# EAGLE design chloe (EAGLE 7.3.0)
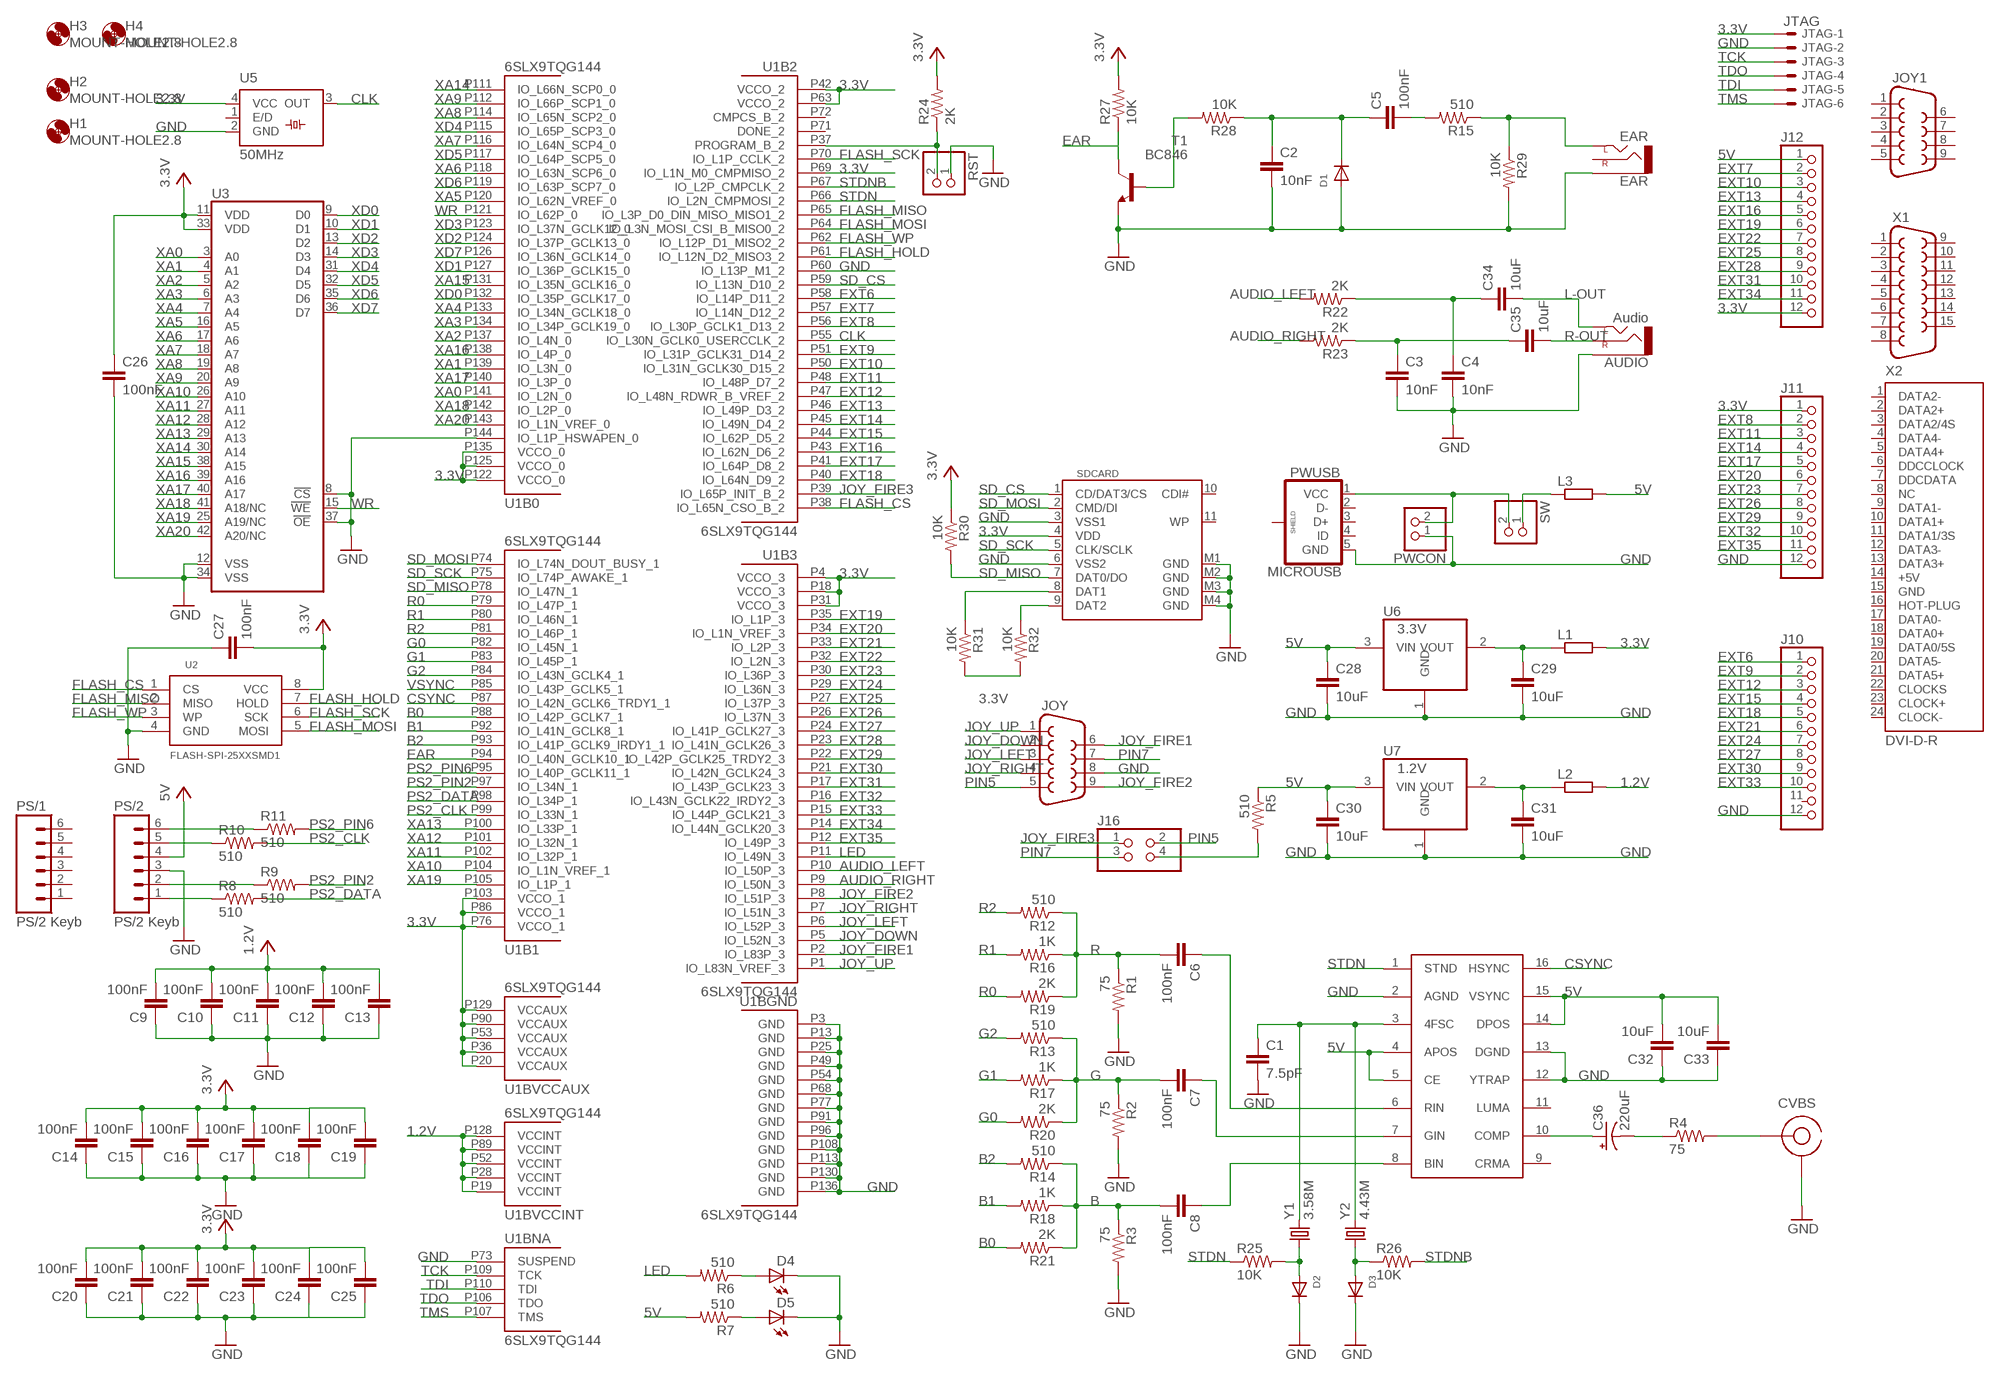
[diagram p0: schematic, sheet 1]

## Parts
AUDIO  Audio  AUDIO-JACKPTH  [AUDIO-JACK]
C1  7.5pF  C-EUC0805  [C0805]
C2  10nF  C-EUC0805  [C0805]
C3  10nF  C-EUC0805  [C0805]
C4  10nF  C-EUC0805  [C0805]
C5  100nF  C-EUC0603  [C0603]
C6  100nF  C-EUC0603  [C0603]
C7  100nF  C-EUC0603  [C0603]
C8  100nF  C-EUC0603  [C0603]
C9  100nF  C-EUC0603  [C0603]
C10  100nF  C-EUC0603  [C0603]
C11  100nF  C-EUC0603  [C0603]
C12  100nF  C-EUC0603  [C0603]
C13  100nF  C-EUC0603  [C0603]
C14  100nF  C-EUC0603  [C0603]
C15  100nF  C-EUC0603  [C0603]
C16  100nF  C-EUC0603  [C0603]
C17  100nF  C-EUC0603  [C0603]
C18  100nF  C-EUC0603  [C0603]
C19  100nF  C-EUC0603  [C0603]
C20  100nF  C-EUC0603  [C0603]
C21  100nF  C-EUC0603  [C0603]
C22  100nF  C-EUC0603  [C0603]
C23  100nF  C-EUC0603  [C0603]
C24  100nF  C-EUC0603  [C0603]
C25  100nF  C-EUC0603  [C0603]
C26  100nF  C-EUC0603  [C0603]
C27  100nF  C-EUC0603  [C0603]
C28  10uF  C-EUC0805  [C0805]
C29  10uF  C-EUC0805  [C0805]
C30  10uF  C-EUC0805  [C0805]
C31  10uF  C-EUC0805  [C0805]
C32  10uF  C-EUC0805  [C0805]
C33  10uF  C-EUC0805  [C0805]
C34  10uF  C-EUC0805  [C0805]
C35  10uF  C-EUC0805  [C0805]
C36  220uF  CPOL-US153CLV-0605  [153CLV-0605]
CVBS  RCA  [RCA]
D1  DIODESOD-323F  [SOD-323F]
D2  DIODESOD-323F  [SOD-323F]
D3  DIODESOD-323F  [SOD-323F]
D4  LEDCHIP-LED0805  [CHIP-LED0805]
D5  LEDCHIP-LED0805  [CHIP-LED0805]
EAR  EAR  AUDIO-JACKPTH  [AUDIO-JACK]
H1  MOUNT-HOLE2.8  [2,8]
H2  MOUNT-HOLE2.8  [2,8]
H3  MOUNT-HOLE2.8  [2,8]
H4  MOUNT-HOLE2.8  [2,8]
J10  PINHD-1X12  [1X12]
J11  PINHD-1X12  [1X12]
J12  PINHD-1X12  [1X12]
J16  PINHD-2X2  [2X02]
JOY  DB9MALE  [DB9_MALE]
JOY1  DB9MALE  [DB9_MALE]
JTAG  JTAG  53047-06  [53047-06]
L1  R-EU_M0805  [M0805]
L2  R-EU_M0805  [M0805]
L3  R-EU_M0805  [M0805]
PS/1  PS/2 Keyb  DINC_MIN_TM_6_1  [DINC/MIN_TM/6_1PRIMARY]
PS/2  PS/2 Keyb  DINC_MIN_TM_6_1  [DINC/MIN_TM/6_1PRIMARY]
PWCON  PINHD-1X2  [1X02]
PWUSB  MICROUSB  [MICRO_USB_1PRIMARY]
R1  75  R-US_M0805  [M0805]
R2  75  R-US_M0805  [M0805]
R3  75  R-US_M0805  [M0805]
R4  75  R-US_M0805  [M0805]
R5  510  R-US_M0805  [M0805]
R6  510  R-US_M0805  [M0805]
R7  510  R-US_M0805  [M0805]
R8  510  R-US_M0805  [M0805]
R9  510  R-US_M0805  [M0805]
R10  510  R-US_M0805  [M0805]
R11  510  R-US_M0805  [M0805]
R12  510  R-US_M0805  [M0805]
R13  510  R-US_M0805  [M0805]
R14  510  R-US_M0805  [M0805]
R15  510  R-US_M0805  [M0805]
R16  1K  R-US_M0805  [M0805]
R17  1K  R-US_M0805  [M0805]
R18  1K  R-US_M0805  [M0805]
R19  2K  R-US_M0805  [M0805]
R20  2K  R-US_M0805  [M0805]
R21  2K  R-US_M0805  [M0805]
R22  2K  R-US_M0805  [M0805]
R23  2K  R-US_M0805  [M0805]
R24  2K  R-US_M0805  [M0805]
R25  10K  R-US_M0805  [M0805]
R26  10K  R-US_M0805  [M0805]
R27  10K  R-US_M0805  [M0805]
R28  10K  R-US_M0805  [M0805]
R29  10K  R-US_M0805  [M0805]
R30  10K  R-US_M0805  [M0805]
R31  10K  R-US_M0805  [M0805]
R32  10K  R-US_M0805  [M0805]
RST  PINHD-1X2  [1X02]
SDCARD  SDCARD  [SDCMF-10915W010]
SW  PINHD-1X2  [1X02]
T1  BC846  [SOT23]
U1  6SLX9TQG144  [TQ144]
U2  FLASH-SPI-25XXSMD1  [SO08-EIAJ]
U3  ISSI_SRAM_8BIT  [TSOP44-II]
U4  AD724  AD725  [SO16W]
U5  50MHz  SM_OSC_1  [SM/OSC_1PRIMARY]
U6  3.3V  REG1117  [SOT223]
U7  1.2V  REG1117  [SOT223]
X1  F15HDH  [HDF15H]
X2  DVI-D-R  [DVI-D-R]
Y1  3.58M  CRYSTALHC49UP  [HC49UP]
Y2  4.43M  CRYSTALHC49UP  [HC49UP]

## Nets
1.2V: C9.2 C10.2 C11.2 C12.2 C13.2 L2.2 U1.P19(BVCCINT:VCCINT) U1.P28(BVCCINT:VCCINT) U1.P52(BVCCINT:VCCINT) U1.P89(BVCCINT:VCCINT) U1.P128(BVCCINT:VCCINT)
3.3V: C14.2 C15.2 C16.2 C17.2 C18.2 C19.2 C20.2 C21.2 C22.2 C23.2 C24.2 C25.2 C26.1 C27.2 J11.1 J12.12 JTAG.1 L1.2 R24.2 R27.2 R30.1 R31.2 R32.2 SDCARD.4(VDD) U1.P4(B3:VCCO_3) U1.P18(B3:VCCO_3) U1.P20(BVCCAUX:VCCAUX) U1.P31(B3:VCCO_3) U1.P36(BVCCAUX:VCCAUX) U1.P42(B2:VCCO_2) U1.P53(BVCCAUX:VCCAUX) U1.P63(B2:VCCO_2) U1.P69(B2:IO_L1N_M0_CMPMISO_2) U1.P76(B1:VCCO_1) U1.P86(B1:VCCO_1) U1.P90(BVCCAUX:VCCAUX) U1.P103(B1:VCCO_1) U1.P122(B0:VCCO_0) U1.P125(B0:VCCO_0) U1.P129(BVCCAUX:VCCAUX) U1.P135(B0:VCCO_0) U2.8(VCC) U3.11(VDD) U3.33(VDD) U5.4(VCC)
5V: C28.1 C30.1 C32.2 C33.2 J12.1 L3.2 PS/2.4 R5.1 R7.2 U4.4(APOS) U4.5(CE) U4.14(DPOS) U4.15(VSYNC) U6.3(VIN) U7.3(VIN)
AUDIO_LEFT: R22.2 U1.P10(B3:IO_L50P_3)
AUDIO_RIGHT: R23.2 U1.P9(B3:IO_L50N_3)
B: C8.2 R3.1 R14.1 R18.1 R21.1
B0: R21.2 U1.P88(B1:IO_L42P_GCLK7_1)
B1: R18.2 U1.P92(B1:IO_L41N_GCLK8_1)
B2: R14.2 U1.P93(B1:IO_L41P_GCLK9_IRDY1_1)
CLK: U1.P55(B2:IO_L30N_GCLK0_USERCCLK_2) U5.3(OUT)
CSYNC: U1.P87(B1:IO_L42N_GCLK6_TRDY1_1) U4.16(HSYNC)
EAR: R27.1 T1.3(C) U1.P94(B1:IO_L40N_GCLK10_1)
EXT6: J10.1 U1.P58(B2:IO_L14P_D11_2)
EXT7: J12.2 U1.P57(B2:IO_L14N_D12_2)
EXT8: J11.2 U1.P56(B2:IO_L30P_GCLK1_D13_2)
EXT9: J10.2 U1.P51(B2:IO_L31P_GCLK31_D14_2)
EXT10: J12.3 U1.P50(B2:IO_L31N_GCLK30_D15_2)
EXT11: J11.3 U1.P48(B2:IO_L48P_D7_2)
EXT12: J10.3 U1.P47(B2:IO_L48N_RDWR_B_VREF_2)
EXT13: J12.4 U1.P46(B2:IO_L49P_D3_2)
EXT14: J11.4 U1.P45(B2:IO_L49N_D4_2)
EXT15: J10.4 U1.P44(B2:IO_L62P_D5_2)
EXT16: J12.5 U1.P43(B2:IO_L62N_D6_2)
EXT17: J11.5 U1.P41(B2:IO_L64P_D8_2)
EXT18: J10.5 U1.P40(B2:IO_L64N_D9_2)
EXT19: J12.6 U1.P35(B3:IO_L1P_3)
EXT20: J11.6 U1.P34(B3:IO_L1N_VREF_3)
EXT21: J10.6 U1.P33(B3:IO_L2P_3)
EXT22: J12.7 U1.P32(B3:IO_L2N_3)
EXT23: J11.7 U1.P30(B3:IO_L36P_3)
EXT24: J10.7 U1.P29(B3:IO_L36N_3)
EXT25: J12.8 U1.P27(B3:IO_L37P_3)
EXT26: J11.8 U1.P26(B3:IO_L37N_3)
EXT27: J10.8 U1.P24(B3:IO_L41P_GCLK27_3)
EXT28: J12.9 U1.P23(B3:IO_L41N_GCLK26_3)
EXT29: J11.9 U1.P22(B3:IO_L42P_GCLK25_TRDY2_3)
EXT30: J10.9 U1.P21(B3:IO_L42N_GCLK24_3)
EXT31: J12.10 U1.P17(B3:IO_L43P_GCLK23_3)
EXT32: J11.10 U1.P16(B3:IO_L43N_GCLK22_IRDY2_3)
EXT33: J10.10 U1.P15(B3:IO_L44P_GCLK21_3)
EXT34: J12.11 U1.P14(B3:IO_L44N_GCLK20_3)
EXT35: J11.11 U1.P12(B3:IO_L49P_3)
FLASH_CS: U1.P38(B2:IO_L65N_CSO_B_2) U2.1(CS)
FLASH_HOLD: U1.P61(B2:IO_L12N_D2_MISO3_2) U2.7(HOLD)
FLASH_MISO: U1.P65(B2:IO_L3P_D0_DIN_MISO_MISO1_2) U2.2(MISO)
FLASH_MOSI: U1.P64(B2:IO_L3N_MOSI_CSI_B_MISO0_2) U2.5(MOSI)
FLASH_SCK: U1.P70(B2:IO_L1P_CCLK_2) U2.6(SCK)
FLASH_WP: U1.P62(B2:IO_L12P_D1_MISO2_2) U2.3(WP)
G: C7.2 R2.1 R13.1 R17.1 R20.1
G0: R20.2 U1.P82(B1:IO_L45N_1)
G1: R17.2 U1.P83(B1:IO_L45P_1)
G2: R13.2 U1.P84(B1:IO_L43N_GCLK4_1)
GND: AUDIO.SLEEVE C1.2 C2.2 C3.2 C4.2 C9.1 C10.1 C11.1 C12.1 C13.1 C14.1 C15.1 C16.1 C17.1 C18.1 C19.1 C20.1 C21.1 C22.1 C23.1 C24.1 C25.1 C26.2 C27.1 C28.2 C29.2 C30.2 C31.2 C32.1 C33.1 CVBS.GND D1.A D2.C D3.C D4.C D5.C EAR.SLEEVE J10.12 J11.12 JOY.8 JTAG.2 PS/2.3 PWCON.1 PWUSB.5(GND) R1.2 R2.2 R3.2 R29.2 RST.1 SDCARD.3(VSS1) SDCARD.6(VSS2) SDCARD.M1(GND) SDCARD.M2(GND) SDCARD.M3(GND) SDCARD.M4(GND) T1.2(E) U1.P3(BGND:GND) U1.P13(BGND:GND) U1.P25(BGND:GND) U1.P49(BGND:GND) U1.P54(BGND:GND) U1.P60(B2:IO_L13P_M1_2) U1.P68(BGND:GND) U1.P73(BNA:SUSPEND) U1.P77(BGND:GND) U1.P91(BGND:GND) U1.P96(BGND:GND) U1.P108(BGND:GND) U1.P113(BGND:GND) U1.P130(BGND:GND) U1.P136(BGND:GND) U1.P144(B0:IO_L1P_HSWAPEN_0) U2.4(GND) U3.8(!CS) U3.12(VSS) U3.34(VSS) U3.37(!OE) U4.2(AGND) U4.12(YTRAP) U4.13(DGND) U5.2(GND) U6.1(GND) U7.1(GND)
JOY_DOWN: JOY.2 U1.P5(B3:IO_L52N_3)
JOY_FIRE1: JOY.6 U1.P2(B3:IO_L83P_3)
JOY_FIRE2: JOY.9 U1.P8(B3:IO_L51P_3)
JOY_FIRE3: J16.1 U1.P39(B2:IO_L65P_INIT_B_2)
JOY_LEFT: JOY.3 U1.P6(B3:IO_L52P_3)
JOY_RIGHT: JOY.4 U1.P7(B3:IO_L51N_3)
JOY_UP: JOY.1 U1.P1(B3:IO_L83N_VREF_3)
L-OUT: AUDIO.TIP(LEFT) C34.2
LED: R6.2 U1.P11(B3:IO_L49N_3)
N$1: PS/2.6 R11.1
N$2: PS/2.5 R10.1
N$3: PS/2.2 R9.1
N$4: PS/2.1 R8.1
N$5: R24.1 RST.2 U1.P37(B2:PROGRAM_B_2)
N$6: R28.2 T1.1(B)
N$7: C2.1 C5.1 D1.C R28.1
N$8: C5.2 R15.2
N$9: EAR.TIP(LEFT) R15.1 R29.1
N$10: C3.1 C35.1 R23.1
N$11: C4.1 C34.1 R22.1
N$12: PWCON.2 PWUSB.1(VCC) SW.2
N$13: L3.1 SW.1
N$14: C29.1 L1.1 U6.2(VOUT)
N$15: J16.4 R5.2
N$17: C31.1 L2.1 U7.2(VOUT)
N$18: R31.1 SDCARD.8(DAT1)
N$19: C8.1 U4.8(BIN)
N$20: R32.1 SDCARD.9(DAT2)
N$21: C7.1 U4.7(GIN)
N$22: C6.1 U4.6(RIN)
N$23: C1.1 U4.3(4FSC) Y1.2 Y2.2
N$24: D3.A R26.1 Y2.1
N$25: D2.A R25.2 Y1.1
N$26: C36.+ U4.10(COMP)
N$27: C36.- R4.1
N$28: CVBS.SIG R4.2
N$31: D4.A R6.1
N$32: D5.A R7.1
PIN5: J16.2 JOY.5
PIN7: J16.3 JOY.7
PS2_CLK: R10.2 U1.P99(B1:IO_L33N_1)
PS2_DATA: R8.2 U1.P98(B1:IO_L34P_1)
PS2_PIN2: R9.2 U1.P97(B1:IO_L34N_1)
PS2_PIN6: R11.2 U1.P95(B1:IO_L40P_GCLK11_1)
R: C6.2 R1.1 R12.1 R16.1 R19.1
R0: R19.2 U1.P79(B1:IO_L47P_1)
R1: R16.2 U1.P80(B1:IO_L46N_1)
R2: R12.2 U1.P81(B1:IO_L46P_1)
R-OUT: AUDIO.RING(RIGHT) C35.2
SD_CS: SDCARD.1(CD/DAT3/CS) U1.P59(B2:IO_L13N_D10_2)
SD_MISO: R30.2 SDCARD.7(DAT0/DO) U1.P78(B1:IO_L47N_1)
SD_MOSI: SDCARD.2(CMD/DI) U1.P74(B1:IO_L74N_DOUT_BUSY_1)
SD_SCK: SDCARD.5(CLK/SCLK) U1.P75(B1:IO_L74P_AWAKE_1)
STDN: R25.1 U1.P66(B2:IO_L2N_CMPMOSI_2) U4.1(STND)
STDNB: R26.2 U1.P67(B2:IO_L2P_CMPCLK_2)
TCK: JTAG.3 U1.P109(BNA:TCK)
TDI: JTAG.5 U1.P110(BNA:TDI)
TDO: JTAG.4 U1.P106(BNA:TDO)
TMS: JTAG.6 U1.P107(BNA:TMS)
VSYNC: U1.P85(B1:IO_L43P_GCLK5_1)
WR: U1.P121(B0:IO_L62P_0) U3.15(!WE)
XA0: U1.P141(B0:IO_L2N_0) U3.3(A0)
XA1: U1.P139(B0:IO_L3N_0) U3.4(A1)
XA2: U1.P137(B0:IO_L4N_0) U3.5(A2)
XA3: U1.P134(B0:IO_L34P_GCLK19_0) U3.6(A3)
XA4: U1.P133(B0:IO_L34N_GCLK18_0) U3.7(A4)
XA5: U1.P120(B0:IO_L62N_VREF_0) U3.16(A5)
XA6: U1.P118(B0:IO_L63N_SCP6_0) U3.17(A6)
XA7: U1.P116(B0:IO_L64N_SCP4_0) U3.18(A7)
XA8: U1.P114(B0:IO_L65N_SCP2_0) U3.19(A8)
XA9: U1.P112(B0:IO_L66P_SCP1_0) U3.20(A9)
XA10: U1.P104(B1:IO_L1N_VREF_1) U3.26(A10)
XA11: U1.P102(B1:IO_L32P_1) U3.27(A11)
XA12: U1.P101(B1:IO_L32N_1) U3.28(A12)
XA13: U1.P100(B1:IO_L33P_1) U3.29(A13)
XA14: U1.P111(B0:IO_L66N_SCP0_0) U3.30(A14)
XA15: U1.P131(B0:IO_L35N_GCLK16_0) U3.38(A15)
XA16: U1.P138(B0:IO_L4P_0) U3.39(A16)
XA17: U1.P140(B0:IO_L3P_0) U3.40(A17)
XA18: U1.P142(B0:IO_L2P_0) U3.41(A18/NC)
XA19: U1.P105(B1:IO_L1P_1) U3.25(A19/NC)
XA20: U1.P143(B0:IO_L1N_VREF_0) U3.42(A20/NC)
XD0: U1.P132(B0:IO_L35P_GCLK17_0) U3.9(D0)
XD1: U1.P127(B0:IO_L36P_GCLK15_0) U3.10(D1)
XD2: U1.P124(B0:IO_L37P_GCLK13_0) U3.13(D2)
XD3: U1.P123(B0:IO_L37N_GCLK12_0) U3.14(D3)
XD4: U1.P115(B0:IO_L65P_SCP3_0) U3.31(D4)
XD5: U1.P117(B0:IO_L64P_SCP5_0) U3.32(D5)
XD6: U1.P119(B0:IO_L63P_SCP7_0) U3.35(D6)
XD7: U1.P126(B0:IO_L36N_GCLK14_0) U3.36(D7)
Unconnected: EAR.RING(RIGHT) J10.11 JOY1.1 JOY1.2 JOY1.3 JOY1.4 JOY1.5 JOY1.6 JOY1.7 JOY1.8 JOY1.9 PS/1.1 PS/1.2 PS/1.3 PS/1.4 PS/1.5 PS/1.6 PWUSB.2(D-) PWUSB.3(D+) PWUSB.4(ID) PWUSB.6(SHIELD) SDCARD.10(CDI#) SDCARD.11(WP) U1.P71(B2:DONE_2) U1.P72(B2:CMPCS_B_2) U4.9(CRMA) U4.11(LUMA) U5.1(E/D) X1.1 X1.2 X1.3 X1.4 X1.5 X1.6 X1.7 X1.8 X1.9 X1.10 X1.11 X1.12 X1.13 X1.14 X1.15 X2.1(DATA2-) X2.2(DATA2+) X2.3(DATA2/4S) X2.4(DATA4-) X2.5(DATA4+) X2.6(DDCCLOCK) X2.7(DDCDATA) X2.8(NC) X2.9(DATA1-) X2.10(DATA1+) X2.11(DATA1/3S) X2.12(DATA3-) X2.13(DATA3+) X2.16(HOT-PLUG) X2.17(DATA0-) X2.18(DATA0+) X2.19(DATA0/5S) X2.20(DATA5-) X2.21(DATA5+) X2.22(CLOCKS) X2.23(CLOCK+) X2.24(CLOCK-)

## Power pins joined to a net without a drawn wire
+5V: X2.14(+5V)
GND: X2.15(GND)

## Library data of the parts
AUDIO EAR = SparkFun-Connectors:AUDIO-JACK: 3.5mm Audio Jack Simple 3.5mm common PCB mount audio jack. SKU: PRT-08032
C1-C35 = rcl:C-EU: CAPACITOR, European symbol
C36 = rcl:CPOL-US: POLARIZED CAPACITOR, American symbol
CVBS = uzebox:RCA: RCA jack
D1-D3 = adafruit:DIODE: Diode SMADIODE - SMA Surface Mount Package 20V 1A Schottky Diode Digikey: 641-1014-6-ND DO-1N4148 - Through Hole Small Current Diode SOD-123 20V 1 A (.5mV Vf) Schottky Diode - Digikey: MBRX120TPMSCT-ND SOD-323 10V 570mA (.38mV Vf, 3ns) Schottky Diode - Digikey: ZLLS410CT-ND SOD-523 30V 30mA Schottky Diode (RB751S-40TE61) - Digikey: RB751S-40TE61CT-ND SOT23-R/W - SOT23 Package (R = Solder Paste/Reflow Ovens, W = Hand-Soldering) BAT54Film 40V 300mA - Digikey: 497-7162-1-ND
D4 D5 = led:LED: LED OSRAM: - CHIPLED LG R971, LG N971, LY N971, LG Q971, LY Q971, LO R971, LY R971 LH N974, LH R974 LS Q976, LO Q976, LY Q976 LO Q996 - Hyper CHIPLED LW Q18S LB Q993, LB Q99A, LB R99A - SideLED LS A670, LO A670, LY A670, LG A670, LP A670 LB A673, LV A673, LT A673, LW A673 LH A674 LY A675 LS A676, LA A676, LO A676, LY A676, LW A676 LS A679, LY A679, LG A679 - Hyper Micro SIDELED® LS Y876, LA Y876, LO Y876, LY Y876 LT Y87S - SmartLED LW L88C, LW L88S LB L89C, LB L89S, LG L890 LS L89K, LO L89K, LY L89K LS L896, LA L896, LO L896, LY L896 - TOPLED LS T670, LO T670, LY T670, LG T670, LP T670 LSG T670, LSP T670, LSY T670, LOP T670, LYG T670 LG T671, LOG T671, LSG T671 LB T673, LV T673, LT T673, LW T673 LH T674 LS T676, LA T676, LO T676, LY T676, LB T676, LH T676, LSB T676, LW T676 LB T67C, LV T67C, LT T67C, LS T67K, LO T67K, LY T67K, LW E67C LS E67B, LA E67B, LO E67B, LY E67B, LB E67C, LV E67C, LT E67C LW T67C LS T679, LY T679, LG T679 LS T770, LO T770, LY T770, LG T770, LP T770 LB T773, LV T773, LT T773, LW T773 LH T774 LS E675, LA E675, LY E675, LS T675 LS T776, LA T776, LO T776, LY T776, LB T776 LHGB T686 LT T68C, LB T68C - Hyper Mini TOPLED® LB M676 - Mini TOPLED Santana® LG M470 LS M47K, LO M47K, LY M47K Source: http://www.osram.convergy.de LUXEON: - LUMILED® LXK2-PW12-R00, LXK2-PW12-S00, LXK2-PW14-U00, LXK2-PW14-V00 LXK2-PM12-R00, LXK2-PM12-S00, LXK2-PM14-U00 LXK2-PE12-Q00, LXK2-PE12-R00, LXK2-PE12-S00, LXK2-PE14-T00, LXK2-PE14-U00 LXK2-PB12-K00, LXK2-PB12-L00, LXK2-PB12-M00, LXK2-PB14-N00, LXK2-PB14-P00, LXK2-PB14-Q00 LXK2-PR12-L00, LXK2-PR12-M00, LXK2-PR14-Q00, LXK2-PR14-R00 LXK2-PD12-Q00, LXK2-PD12-R00, LXK2-PD12-S00 LXK2-PH12-R00, LXK2-PH12-S00 LXK2-PL12-P00, LXK2-PL12-Q00, LXK2-PL12-R00 Source: www.luxeon.com KINGBRIGHT: KA-3528ASYC Source: www.kingbright.com
H1-H4 = holes:MOUNT-HOLE: MOUNTING HOLE with drill center marker
J10-J12 = pinhead:PINHD-1X12: PIN HEADER
J16 = pinhead:PINHD-2X2: PIN HEADER
JOY JOY1 = SparkFun-Connectors:DB9: DB9 Connector Standard DB9 (D-Sub 9) serial connector. Can be used for CAN bus as well as RS485 and RS232. Footprint production proven. Spark Fun Electronics SKU : PRT-00429
JTAG = con-molex:53?-06: CONNECTOR wire to board 1.25 mm (.049 inch) pitch header; MPN: 53047-0610-C; OC_FARNELL: 9733078; OC_NEWARK: 03M2965
L1-L3 = rcl:R-EU_: RESISTOR, European symbol
PS/1 PS/2 = ZX_UNO_0_14:DINC_MIN_TM_6_1
PWCON RST SW = pinhead:PINHD-1X2: PIN HEADER
PWUSB = zxuno_rev_mcleod:MICROUSB
R1-R32 = rcl:R-US_: RESISTOR, American symbol
SDCARD = zxuno_rev_mcleod:SDCARD: SD card connector KINGFONT SDCMF-10915W010
T1 = transistor:BC846: NPN TRANSISTOR
U1 = xilinx_devices_V6:6SLX9TQG144: Xilinx FPGA: 6SLX9TQG144
U2 = GadgetFactory:FLASH-SPI-25XX: SPI Flash
U3 = GadgetFactory:ISSI_SRAM_8BIT
U4 = ad725:AD725
U5 = ZX_UNO_0_15:SM_OSC_1
U6 U7 = burr-brown:REG1117: 800mA and 1A Low Dropout (LDO) Positive Regulator 1.8V, 2.5V, 2.85V, 3.3V, 5V, and Adj; MPN: REG1117; OC_FARNELL: 1097566; OC_NEWARK: 14P6981
X1 = con-subd:F15: SUB-D; OC_FARNELL: unknown; OC_NEWARK: unknown
X2 = con-molex:DVI-D-R: CONNECTOR MiroCross(TM)-DVI i/0 plug and receptacle connector system (scart); OC_FARNELL: unknown; OC_NEWARK: unknown
Y1 Y2 = crystal:CRYSTAL: CRYSTAL; OC_FARNELL: unknown; OC_NEWARK: unknown

## Board
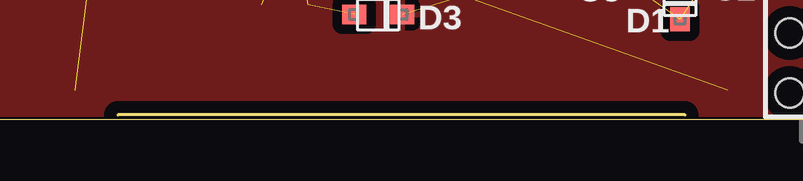
[diagram p1: board, top side]
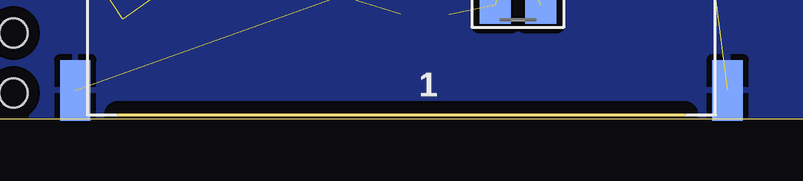
[diagram p2: board, bottom side, seen from below]

Size 23.62 x 0 mm. Coordinates in mm from the lower left corner, seen from the top.
Copper layers (1*16): Top 0.035mm / dielectric 1.5mm / Bottom 0.035mm
Design rules "EagleRules": minimum track width 7mil, minimum drill 12mil, track to track 7mil, track to pad 7mil, pad to pad 7mil, via to via 7mil, smd to smd 0mil, copper to edge 20mil, drill to drill 10mil, minimum pad ring 10mil, minimum via ring 6mil, stop-mask expansion 2mil, vias tented up to drill 25mil, thermal gap 10mil
Milling: 4 lines

### Footprints (pad centres in the part's own frame; a part is rotated, then mirrored left to right if it is on the bottom)
AUDIO-JACK = drill 1.3 pad 2.184: RING 5,5; RSH 5,2.5; SLEEVE 0,0; TIP 5,-5; TSH 5,-2.5 | hole 1.2: 0,5; -2.5,5; -2.5,-5; 0,-5; 5,0
C0805 = smd 1.3 x 1.5: 1 -0.95,0; 2 0.95,0
C0603 = smd 1.1 x 1: 1 -0.85,0; 2 0.85,0
153CLV-0605 = smd 3.5 x 1.6: + 2.7,0; - -2.7,0
RCA = drill 2.3 pad 3.81: GND 0,0; SIG 0,-4.5 | hole 2.8: -4.175,3.15; 4.175,3.15
SOD-323F = smd 1 x 0.8: A -1,0; C 1,0
CHIP-LED0805 = smd 1.2 x 1.2: A 0,-1.05; C 0,1.05
2,8 = hole 2.8: 0,0
1X12 = drill 1.016 octagon: 1 -13.97,0; 2 -11.43,0; 3 -8.89,0; 4 -6.35,0; 5 -3.81,0; 6 -1.27,0; 7 1.27,0; 8 3.81,0; 9 6.35,0; 10 8.89,0; 11 11.43,0; 12 13.97,0
2X02 = drill 1.016 octagon: 1 -1.27,-1.27; 2 -1.27,1.27; 3 1.27,-1.27; 4 1.27,1.27
DB9_MALE = drill 1.016 pad 1.88: 1 5.54,-1.42; 2 2.77,-1.42; 3 0,-1.42; 4 -2.77,-1.42; 5 -5.54,-1.42; 6 4.15,1.42; 7 1.38,1.42; 8 -1.38,1.42; 9 -4.15,1.42 | drill 3.302 pad 5.08: G1 -12.5,0; G2 12.5,0
53047-06 = drill 0.5 pad 0.698 long: 1 3.125,0.45; 2 1.875,0.45; 3 0.625,0.45; 4 -0.625,0.45; 5 -1.875,0.45; 6 -3.125,0.45
M0805 = smd 1.3 x 1.6: 1 -0.95,0; 2 0.95,0
DINC/MIN_TM/6_1PRIMARY = drill 0.889 pad 1.575 square: 1 -1.295,-8.509 | drill 0.889 pad 1.575: 2 1.295,-8.509; 3 -3.353,-8.509; 4 3.353,-8.509; 5 -3.353,-10.998; 6 3.353,-10.998 | drill 2.311 pad 2.845: 7 -6.756,-5.512; 8 0,-4.699; 9 6.756,-5.512
1X02 = drill 1.016 octagon: 1 -1.27,0; 2 1.27,0
MICRO_USB_1PRIMARY = smd 0.406 x 2.108: 1 -1.295,0.381; 2 -0.66,0.381; 3 0,0.381; 4 0.66,0.381; 5 1.295,0.381 | smd 7.366 x 4.191 bottom: 6 0,-1.524 | drill 1.194 pad 1.538 square: 7 -2.87,-2.667; 8 2.87,-2.667 | hole 0.457: -2.007,-0.533; 2.007,-0.533
SDCMF-10915W010 = smd 0.711 x 1.422: 1 7.366,13.462; 2 4.826,13.462; 3 2.286,13.462; 4 -0.254,13.462; 5 -2.794,13.462; 6 -5.334,13.462; 7 -7.874,13.462; 8 -9.398,13.462; 9 9.906,13.462; 10 -11.938,13.462; 11 -10.668,13.462 | smd 1.27 x 2.54: M1 12.192,11.43; M2 13.97,-2.54; M3 -13.208,-2.54; M4 -13.208,11.43 | hole 1.6: 9.906,10.414 | hole 1.1: -11.176,10.414
SOT23 = smd 1 x 1.4: 1 -0.95,-1.1; 2 0.95,-1.1; 3 0,1.1
TQ144 = smd 1.6 x 0.3: P1 -11.1,8.75; P2 -11.1,8.25; P3 -11.1,7.75; P4 -11.1,7.25; P5 -11.1,6.75; P6 -11.1,6.25; P7 -11.1,5.75; P8 -11.1,5.25; P9 -11.1,4.75; P10 -11.1,4.25; P11 -11.1,3.75; P12 -11.1,3.25; P13 -11.1,2.75; P14 -11.1,2.25; P15 -11.1,1.75; P16 -11.1,1.25; P17 -11.1,0.75; P18 -11.1,0.25; P19 -11.1,-0.25; P20 -11.1,-0.75; P21 -11.1,-1.25; P22 -11.1,-1.75; P23 -11.1,-2.25; P24 -11.1,-2.75; P25 -11.1,-3.25; P26 -11.1,-3.75; P27 -11.1,-4.25; P28 -11.1,-4.75; P29 -11.1,-5.25; P30 -11.1,-5.75; P31 -11.1,-6.25; P32 -11.1,-6.75; P33 -11.1,-7.25; P34 -11.1,-7.75; P35 -11.1,-8.25; P36 -11.1,-8.75; P73 11.1,-8.75; P74 11.1,-8.25; P75 11.1,-7.75; P76 11.1,-7.25; P77 11.1,-6.75; P78 11.1,-6.25; P79 11.1,-5.75; P80 11.1,-5.25; P81 11.1,-4.75; P82 11.1,-4.25; P83 11.1,-3.75; P84 11.1,-3.25; P85 11.1,-2.75; P86 11.1,-2.25; P87 11.1,-1.75; P88 11.1,-1.25; P89 11.1,-0.75; P90 11.1,-0.25; P91 11.1,0.25; P92 11.1,0.75; P93 11.1,1.25; P94 11.1,1.75; P95 11.1,2.25; P96 11.1,2.75; P97 11.1,3.25; P98 11.1,3.75; P99 11.1,4.25; P100 11.1,4.75; P101 11.1,5.25; P102 11.1,5.75; P103 11.1,6.25; P104 11.1,6.75; P105 11.1,7.25; P106 11.1,7.75; P107 11.1,8.25; P108 11.1,8.75 | smd 0.3 x 1.6: P37 -8.75,-11.1; P38 -8.25,-11.1; P39 -7.75,-11.1; P40 -7.25,-11.1; P41 -6.75,-11.1; P42 -6.25,-11.1; P43 -5.75,-11.1; P44 -5.25,-11.1; P45 -4.75,-11.1; P46 -4.25,-11.1; P47 -3.75,-11.1; P48 -3.25,-11.1; P49 -2.75,-11.1; P50 -2.25,-11.1; P51 -1.75,-11.1; P52 -1.25,-11.1; P53 -0.75,-11.1; P54 -0.25,-11.1; P55 0.25,-11.1; P56 0.75,-11.1; P57 1.25,-11.1; P58 1.75,-11.1; P59 2.25,-11.1; P60 2.75,-11.1; P61 3.25,-11.1; P62 3.75,-11.1; P63 4.25,-11.1; P64 4.75,-11.1; P65 5.25,-11.1; P66 5.75,-11.1; P67 6.25,-11.1; P68 6.75,-11.1; P69 7.25,-11.1; P70 7.75,-11.1; P71 8.25,-11.1; P72 8.75,-11.1; P109 8.75,11.1; P110 8.25,11.1; P111 7.75,11.1; P112 7.25,11.1; P113 6.75,11.1; P114 6.25,11.1; P115 5.75,11.1; P116 5.25,11.1; P117 4.75,11.1; P118 4.25,11.1; P119 3.75,11.1; P120 3.25,11.1; P121 2.75,11.1; P122 2.25,11.1; P123 1.75,11.1; P124 1.25,11.1; P125 0.75,11.1; P126 0.25,11.1; P127 -0.25,11.1; P128 -0.75,11.1; P129 -1.25,11.1; P130 -1.75,11.1; P131 -2.25,11.1; P132 -2.75,11.1; P133 -3.25,11.1; P134 -3.75,11.1; P135 -4.25,11.1; P136 -4.75,11.1; P137 -5.25,11.1; P138 -5.75,11.1; P139 -6.25,11.1; P140 -6.75,11.1; P141 -7.25,11.1; P142 -7.75,11.1; P143 -8.25,11.1; P144 -8.75,11.1
SO08-EIAJ = smd 0.61 x 2.21: 1 -1.905,-3.378; 2 -0.635,-3.378; 3 0.635,-3.378; 4 1.905,-3.378; 5 1.905,3.353; 6 0.635,3.353; 7 -0.635,3.353; 8 -1.905,3.353
TSOP44-II = smd 0.4 x 1.3: 1 -8.4,-5.8; 2 -7.6,-5.8; 3 -6.8,-5.8; 4 -6,-5.8; 5 -5.2,-5.8; 6 -4.4,-5.8; 7 -3.6,-5.8; 8 -2.8,-5.8; 9 -2,-5.8; 10 -1.2,-5.8; 11 -0.4,-5.8; 12 0.4,-5.8; 13 1.2,-5.8; 14 2,-5.8; 15 2.8,-5.8; 16 3.6,-5.8; 17 4.4,-5.8; 18 5.2,-5.8; 19 6,-5.8; 20 6.8,-5.8; 21 7.6,-5.8; 22 8.4,-5.8; 23 8.4,5.8; 24 7.6,5.8; 25 6.8,5.8; 26 6,5.8; 27 5.2,5.8; 28 4.4,5.8; 29 3.6,5.8; 30 2.8,5.8; 31 2,5.8; 32 1.2,5.8; 33 0.4,5.8; 34 -0.4,5.8; 35 -1.2,5.8; 36 -2,5.8; 37 -2.8,5.8; 38 -3.6,5.8; 39 -4.4,5.8; 40 -5.2,5.8; 41 -6,5.8; 42 -6.8,5.8; 43 -7.6,5.8; 44 -8.4,5.8
SO16W = smd 0.6 x 2.2: 1 -4.445,-4.6; 2 -3.175,-4.6; 3 -1.905,-4.6; 4 -0.635,-4.6; 5 0.635,-4.6; 6 1.905,-4.6; 7 3.175,-4.6; 8 4.445,-4.6; 9 4.445,4.6; 10 3.175,4.6; 11 1.905,4.6; 12 0.635,4.6; 13 -0.635,4.6; 14 -1.905,4.6; 15 -3.175,4.6; 16 -4.445,4.6
SM/OSC_1PRIMARY = smd 1.778 x 1.981: 1 0,0; 2 -5.08,0; 3 -5.08,-4.191; 4 0,-4.191
SOT223 = smd 1.499 x 2.007: 1 -2.261,-3.15; 2 0.025,-3.15; 3 2.311,-3.15 | smd 3.81 x 2.007: 4 0,3.15
HDF15H = drill 0.9 octagon: 1 4.329,2.54 | drill 0.9: 2 2.043,2.54; 3 -0.243,2.54; 4 -2.529,2.54; 5 -4.815,2.54; 6 5.472,0; 7 3.186,0; 8 0.9,0; 9 -1.386,0; 10 -3.672,0; 11 4.329,-2.54; 12 2.043,-2.54; 13 -0.243,-2.54; 14 -2.529,-2.54; 15 -4.815,-2.54 | hole 3: -12.5,0; 12.5,0
DVI-D-R = drill 0.864 pad 1.397: 1 -9.525,6.985; 2 -7.62,6.985; 3 -5.715,6.985; 4 -3.81,6.985; 5 -1.905,6.985; 6 0,6.985; 7 1.905,6.985; 8 3.81,6.985; 9 -9.525,5.08; 10 -7.62,5.08; 11 -5.715,5.08; 12 -3.81,5.08; 13 -1.905,5.08; 14 0,5.08; 15 1.905,5.08; 16 3.81,5.08; 17 -9.525,3.175; 18 -7.62,3.175; 19 -5.715,3.175; 20 -3.81,3.175; 21 -1.905,3.175; 22 0,3.175; 23 1.905,3.175; 24 3.81,3.175 | hole 1.93: -15.367,3.175; 15.367,3.175; -9.525,-0.127; 9.525,-0.127
HC49UP = smd 5.334 x 1.93: 1 -4.826,0; 2 4.826,0

### Placement (x,y rotation side)
AUDIO  -23.95,12.88 0 top  (outside the outline)
C1  1.4,9.51 180 top  (outside the outline)
C2  25.37,7.92 90 top  (outside the outline)
C3  53.59,43.84 90 top  (outside the outline)
C4  49.14,43.84 90 top  (outside the outline)
C5  20.76,6.49 0 top  (outside the outline)
C6  0.44,13.16 270 top  (outside the outline)
C7  2.98,12.68 270 top  (outside the outline)
C8  0.92,16.34 0 top  (outside the outline)
C9  20.88,40.74 0 bottom  (outside the outline)
C10  27.83,40.74 0 bottom  (outside the outline)
C11  34.75,32.67 270 bottom  (outside the outline)
C12  25.31,22.19 0 bottom  (outside the outline)
C13  16.2,34.16 270 bottom  (outside the outline)
C14  24.04,40.74 180 bottom  (outside the outline)
C15  33.01,40.74 0 bottom  (outside the outline)
C16  34.77,36.46 270 bottom  (outside the outline)
C17  34.71,29.08 90 bottom  (outside the outline)
C18  30.05,22.19 180 bottom  (outside the outline)
C19  21.76,22.17 180 bottom  (outside the outline)
C20  16.99,22.17 180 bottom  (outside the outline)
C21  16.18,25.86 90 bottom  (outside the outline)
C22  16.18,31.02 90 bottom  (outside the outline)
C23  16.2,37.23 90 bottom  (outside the outline)
C24  27.19,36.24 180 bottom  (outside the outline)
C25  2.98,41.26 180 bottom  (outside the outline)
C26  54.86,31.22 90 top  (outside the outline)
C27  -8.92,26.81 270 top  (outside the outline)
C28  -16.22,15.7 0 top  (outside the outline)
C29  -22.26,15.7 180 top  (outside the outline)
C30  -13.11,21.64 180 top  (outside the outline)
C31  -14.45,24.64 180 top  (outside the outline)
C32  1.4,7.29 0 top  (outside the outline)
C33  -16.22,13.16 180 top  (outside the outline)
C34  46.92,43.84 90 top  (outside the outline)
C35  55.81,43.84 90 top  (outside the outline)
C36  27.43,51.1 90 top  (outside the outline)
CVBS  -21.07,24.79 270 top  (outside the outline)
D1  23.42,4.98 270 top  (outside the outline)
D2  -23.57,2.44 180 top  (outside the outline)
D3  10.84,4.18 0 top  (outside the outline)
D4  53.31,54.12 270 top  (outside the outline)
D5  53.31,51.26 270 top  (outside the outline)
EAR  32.99,3.41 90 top  (outside the outline)
H1  68.98,68.41 0 top  (outside the outline)
H2  -24.96,67.81 0 top  (outside the outline)
H3  68.03,3.44 0 top  (outside the outline)
H4  -24.96,3.16 0 top  (outside the outline)
J10  -5.39,69.79 0 top  (outside the outline)
J11  -6.66,67.25 0 top  (outside the outline)
J12  -5.39,64.71 0 top  (outside the outline)
J16  53.43,18.44 180 top  (outside the outline)
JOY  50.01,61.82 0 top  (outside the outline)
JOY1  18.46,61.66 0 top  (outside the outline)
JTAG  43.74,20.19 0 top  (outside the outline)
L1  -21.15,27.92 0 top  (outside the outline)
L2  -8.55,31.27 90 top  (outside the outline)
L3  -20.19,11.89 90 top  (outside the outline)
PS/1  50.49,0.14 180 top  (outside the outline)
PS/2  71.6,15.46 270 top  (outside the outline)
PWCON  -17.65,8.08 90 top  (outside the outline)
PWUSB  -12.79,2.74 0 top  (outside the outline)
R1  16.8,10.14 0 top  (outside the outline)
R2  16.8,8.08 0 top  (outside the outline)
R3  16.8,6.02 0 top  (outside the outline)
R4  38.5,47.01 180 top  (outside the outline)
R5  42.35,12.84 180 top  (outside the outline)
R6  47.75,54.12 180 top  (outside the outline)
R7  47.75,51.26 180 top  (outside the outline)
R8  42.35,8.4 180 top  (outside the outline)
R9  42.35,6.18 180 top  (outside the outline)
R10  42.35,10.62 180 top  (outside the outline)
R11  42.35,3.95 180 top  (outside the outline)
R12  6.16,10.62 0 top  (outside the outline)
R13  11.72,7.13 90 top  (outside the outline)
R14  17.27,13.32 90 top  (outside the outline)
R15  32.19,12.53 180 top  (outside the outline)
R16  6.16,12.68 0 top  (outside the outline)
R17  9.65,7.13 90 top  (outside the outline)
R18  15.21,13.32 90 top  (outside the outline)
R19  6.16,14.75 0 top  (outside the outline)
R20  6.32,8.24 0 top  (outside the outline)
R21  12.67,13.32 90 top  (outside the outline)
R22  44.7,43.84 90 top  (outside the outline)
R23  51.36,43.84 90 top  (outside the outline)
R24  7.67,41.26 0 top  (outside the outline)
R25  -6.06,7.45 0 bottom  (outside the outline)
R26  6.95,4.59 0 bottom  (outside the outline)
R27  20.45,12.05 270 top  (outside the outline)
R28  21.08,8.72 0 top  (outside the outline)
R29  27.59,12.53 180 top  (outside the outline)
R30  -4.48,18.88 0 top  (outside the outline)
R31  -8.76,19.45 270 top  (outside the outline)
R32  -21.97,32.02 180 top  (outside the outline)
RST  8.22,47.29 315 top  (outside the outline)
SDCARD  12.19,3.56 0 bottom
SW  -14.95,8.08 270 top  (outside the outline)
T1  23.46,12.21 0 top  (outside the outline)
U1  25.49,31.46 270 top  (outside the outline)
U2  -4.64,25.54 0 top  (outside the outline)
U3  47.08,31.69 270 top  (outside the outline)
U4  6.12,28.84 90 top  (outside the outline)
U5  27.95,29.39 180 bottom  (outside the outline)
U6  -21.15,21.57 0 top  (outside the outline)
U7  -13.4,30.15 0 top  (outside the outline)
X1  -16.5,46.34 270 top  (outside the outline)
X2  68.71,40.94 90 top  (outside the outline)
Y1  -3.84,40.19 0 top  (outside the outline)
Y2  -3.92,45.55 180 top  (outside the outline)

### Tracks (layer width: path | path; a pad name or v marks a point on that pad's centre or on a via)
1.2V  (10 unrouted)
3.3V  (44 unrouted)
5V  (14 unrouted)
AUDIO_LEFT  (1 unrouted)
AUDIO_RIGHT  (1 unrouted)
B  (4 unrouted)
B0  (1 unrouted)
B1  (1 unrouted)
B2  (1 unrouted)
CLK  (1 unrouted)
CSYNC  (1 unrouted)
EAR  (2 unrouted)
EXT6  (1 unrouted)
EXT7  (1 unrouted)
EXT8  (1 unrouted)
EXT9  (1 unrouted)
EXT10  (1 unrouted)
EXT11  (1 unrouted)
EXT12  (1 unrouted)
EXT13  (1 unrouted)
EXT14  (1 unrouted)
EXT15  (1 unrouted)
EXT16  (1 unrouted)
EXT17  (1 unrouted)
EXT18  (1 unrouted)
EXT19  (1 unrouted)
EXT20  (1 unrouted)
EXT21  (1 unrouted)
EXT22  (1 unrouted)
EXT23  (1 unrouted)
EXT24  (1 unrouted)
EXT25  (1 unrouted)
EXT26  (1 unrouted)
EXT27  (1 unrouted)
EXT28  (1 unrouted)
EXT29  (1 unrouted)
EXT30  (1 unrouted)
EXT31  (1 unrouted)
EXT32  (1 unrouted)
EXT33  (1 unrouted)
EXT34  (1 unrouted)
EXT35  (1 unrouted)
FLASH_CS  (1 unrouted)
FLASH_HOLD  (1 unrouted)
FLASH_MISO  (1 unrouted)
FLASH_MOSI  (1 unrouted)
FLASH_SCK  (1 unrouted)
FLASH_WP  (1 unrouted)
G  (4 unrouted)
G0  (1 unrouted)
G1  (1 unrouted)
G2  (1 unrouted)
GND  (83 unrouted)
  pour Bottom (isolate 0.406): -27.91,55.65 57.91,55.65 57.91,-0.02 -27.81,-0.02
  pour Top (isolate 0.406): -27.77,0 57.91,0 57.91,55.63 -27.77,55.63
JOY_DOWN  (1 unrouted)
JOY_FIRE1  (1 unrouted)
JOY_FIRE2  (1 unrouted)
JOY_FIRE3  (1 unrouted)
JOY_LEFT  (1 unrouted)
JOY_RIGHT  (1 unrouted)
JOY_UP  (1 unrouted)
L-OUT  (1 unrouted)
LED  (1 unrouted)
N$1  (1 unrouted)
N$2  (1 unrouted)
N$3  (1 unrouted)
N$4  (1 unrouted)
N$5  (2 unrouted)
N$6  (1 unrouted)
N$7  (3 unrouted)
N$8  (1 unrouted)
N$9  (2 unrouted)
N$10  (2 unrouted)
N$11  (2 unrouted)
N$12  (2 unrouted)
N$13  (1 unrouted)
N$14  (2 unrouted)
N$15  (1 unrouted)
N$17  (2 unrouted)
N$18  (1 unrouted)
N$19  (1 unrouted)
N$20  (1 unrouted)
N$21  (1 unrouted)
N$22  (1 unrouted)
N$23  (3 unrouted)
N$24  (2 unrouted)
N$25  (2 unrouted)
N$26  (1 unrouted)
N$27  (1 unrouted)
N$28  (1 unrouted)
N$31  (1 unrouted)
N$32  (1 unrouted)
PIN5  (1 unrouted)
PIN7  (1 unrouted)
PS2_CLK  (1 unrouted)
PS2_DATA  (1 unrouted)
PS2_PIN2  (1 unrouted)
PS2_PIN6  (1 unrouted)
R  (4 unrouted)
R0  (1 unrouted)
R1  (1 unrouted)
R2  (1 unrouted)
R-OUT  (1 unrouted)
SD_CS  (1 unrouted)
SD_MISO  (2 unrouted)
SD_MOSI  (1 unrouted)
SD_SCK  (1 unrouted)
STDN  (2 unrouted)
STDNB  (1 unrouted)
TCK  (1 unrouted)
TDI  (1 unrouted)
TDO  (1 unrouted)
TMS  (1 unrouted)
WR  (1 unrouted)
XA0  (1 unrouted)
XA1  (1 unrouted)
XA2  (1 unrouted)
XA3  (1 unrouted)
XA4  (1 unrouted)
XA5  (1 unrouted)
XA6  (1 unrouted)
XA7  (1 unrouted)
XA8  (1 unrouted)
XA9  (1 unrouted)
XA10  (1 unrouted)
XA11  (1 unrouted)
XA12  (1 unrouted)
XA13  (1 unrouted)
XA14  (1 unrouted)
XA15  (1 unrouted)
XA16  (1 unrouted)
XA17  (1 unrouted)
XA18  (1 unrouted)
XA19  (1 unrouted)
XA20  (1 unrouted)
XD0  (1 unrouted)
XD1  (1 unrouted)
XD2  (1 unrouted)
XD3  (1 unrouted)
XD4  (1 unrouted)
XD5  (1 unrouted)
XD6  (1 unrouted)
XD7  (1 unrouted)

### Text on the board
tPlace: (C)2016 ZX-Uno Team / http://www.zxuno.com | v4.1
tNames: 1 | 1 | 1
bNames: 1 | 1 | 1
_tNames: C36 | R6 | J10 | D4 | R7 | J11 | D5 | J12 | C34 | R23 | AUDIO | RST | CVBS | R4 | R24 | U1 | R22 | C4 | C3 | C35 | U7 | R32 | L2 | U2 | C26 | L1 | U6 | C27 | C31 | C30 | R31 | U3 | U4 | R30 | R21 | R14 | J16 | JOY | C28 | C8 | C7 | R18 | JTAG | C29 | T1 | R29 | R15 | R19 | R27 | R5 | L3 | PWUSB | C33 | R16 | R13 | R10 | C6 | C1 | R12 | R1 | R8 | R20 | R2 | R28 | R9 | PWCON | SW | R17 | R3 | C2 | C32 | D3 | C5 | D1 | RGB | EAR | R11 | PS/2 | D2 | Y1 | Y2
_bNames: C25 | C14 | C9 | C10 | C15 | C23 | C24 | C16 | C13 | C22 | C11 | C17 | C21 | U5 | C20 | C19 | C18 | C12 | R25 | R26
_tValues: JTAG | RGB | EAR